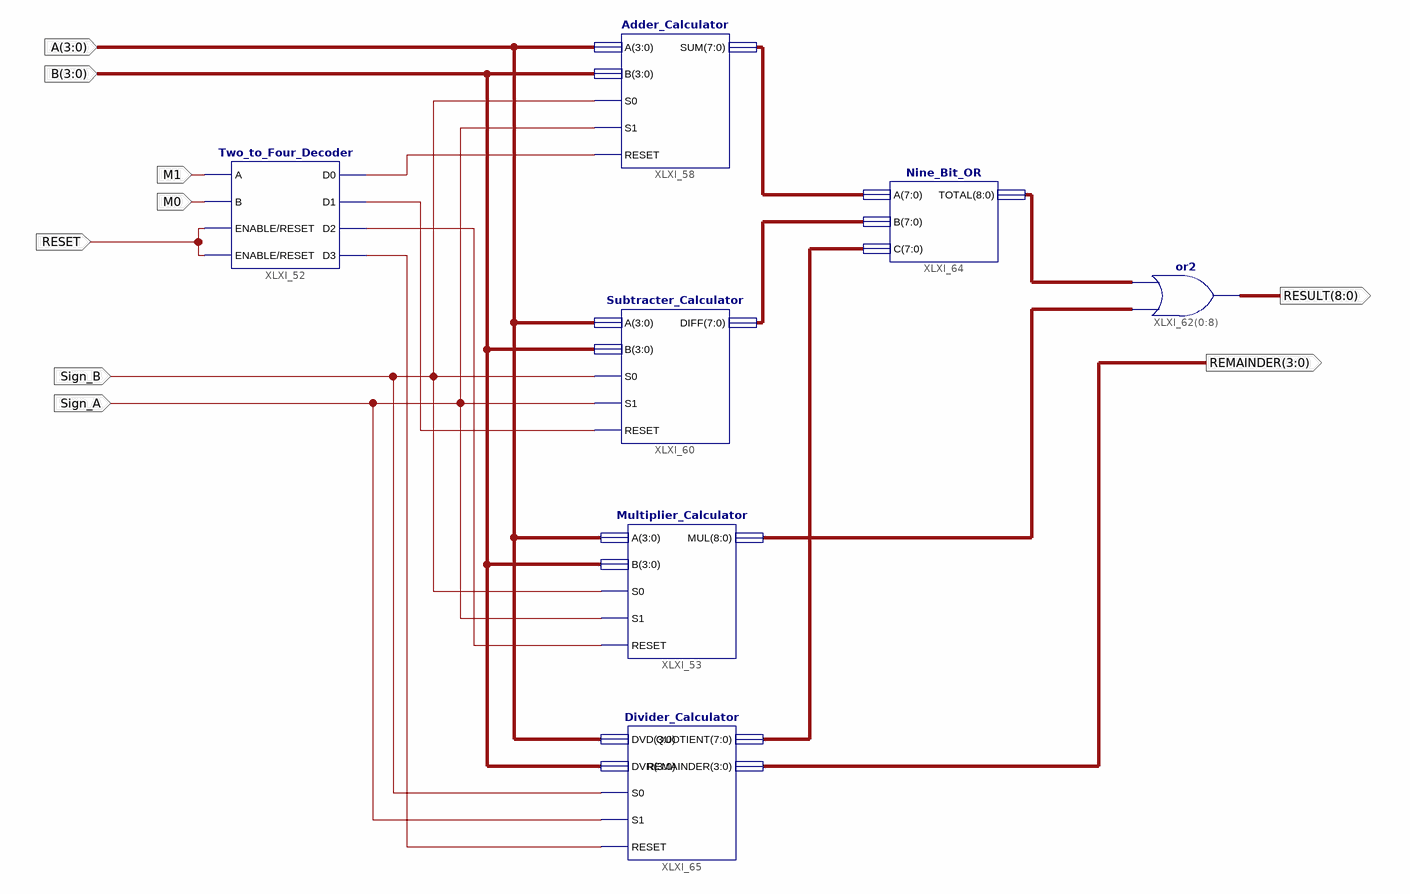
[diagram p0: schematic sheet 1]
// Xilinx ISE schematic Calculator.sch (spartan6) as structural Verilog: 7 symbols, 9 ports
module Calculator (
  input  RESET,
  input  M1,
  input  M0,
  input  Sign_A,
  input  Sign_B,
  input  [3:0] B,
  input  [3:0] A,
  output [8:0] RESULT,
  output [3:0] REMAINDER
);

  wire XLXN_91, XLXN_93, XLXN_150, XLXN_152;
  wire [7:0] XLXN_135, XLXN_136, XLXN_138;
  wire [8:0] MUL, XLXN_137;

  Two_to_Four_Decoder XLXI_52 (
    .A(M1), .B(M0), .D0(XLXN_91), .D1(XLXN_93), .D2(XLXN_150), .D3(XLXN_152), .ENABLE(RESET), .RESET(RESET));
  Adder_Calculator XLXI_58 (.A(A), .B(B), .RESET(XLXN_91), .S0(Sign_B), .S1(Sign_A), .SUM(XLXN_135));
  Multiplier_Calculator XLXI_53 (.A(A), .B(B), .MUL(MUL), .RESET(XLXN_150), .S0(Sign_B), .S1(Sign_A));
  Subtracter_Calculator XLXI_60 (.A(A), .B(B), .DIFF(XLXN_136), .RESET(XLXN_93), .S0(Sign_B), .S1(Sign_A));
  assign RESULT = MUL | XLXN_137;  // or2 XLXI_62[0..8], 9 bits wide
  Nine_Bit_OR XLXI_64 (.A(XLXN_135), .B(XLXN_136), .C(XLXN_138), .TOTAL(XLXN_137));
  Divider_Calculator XLXI_65 (
    .DVD(A), .DVR(B), .QUOTIENT(XLXN_138), .REMAINDER(REMAINDER), .RESET(XLXN_152), .S0(Sign_B), .S1(Sign_A));
endmodule
